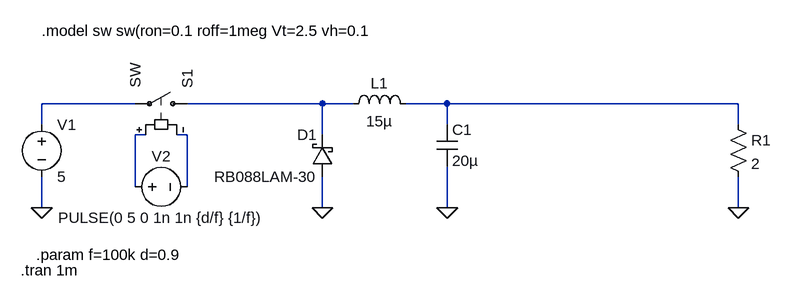
[diagram p0: schematic discrete_buck.asc]
discrete_buck.asc, the LTspice schematic file:
Version 4
SHEET 1 1160 680
WIRE 176 80 32 80
WIRE 464 80 256 80
WIRE 512 80 464 80
WIRE 656 80 592 80
WIRE 1104 80 656 80
WIRE 32 112 32 80
WIRE 656 112 656 80
WIRE 1104 112 1104 80
WIRE 192 128 176 128
WIRE 256 128 240 128
WIRE 464 128 464 80
WIRE 176 208 176 128
WIRE 256 208 256 128
WIRE 32 240 32 192
WIRE 464 240 464 192
WIRE 656 240 656 176
WIRE 1104 240 1104 192
FLAG 32 240 0
FLAG 464 240 0
FLAG 656 240 0
FLAG 1104 240 0
SYMBOL voltage 32 96 R0
WINDOW 123 0 0 Left 0
WINDOW 39 0 0 Left 0
SYMATTR InstName V1
SYMATTR Value 5
SYMBOL sw 272 80 M270
SYMATTR InstName S1
SYMBOL schottky 480 192 R180
WINDOW 0 24 64 Left 2
WINDOW 3 24 0 Left 2
SYMATTR InstName D1
SYMATTR Value RB088LAM-30
SYMATTR Description Diode
SYMATTR Type diode
SYMBOL ind 496 96 R270
WINDOW 0 32 56 VTop 2
WINDOW 3 5 56 VBottom 2
SYMATTR InstName L1
SYMATTR Value 15µ
SYMATTR SpiceLine Rser=0.1
SYMBOL res 1088 96 R0
SYMATTR InstName R1
SYMATTR Value 2
SYMBOL cap 640 112 R0
SYMATTR InstName C1
SYMATTR Value 20µ
SYMATTR SpiceLine Rser=0.02
SYMBOL voltage 160 208 M90
WINDOW 0 -32 56 VBottom 2
WINDOW 3 32 56 VTop 2
WINDOW 123 0 0 Left 0
WINDOW 39 0 0 Left 0
SYMATTR InstName V2
SYMATTR Value PULSE(0 5 0 1n 1n {d/f} {1/f})
TEXT 32 -32 Left 2 !.model sw sw(ron=0.1 roff=1meg Vt=2.5 vh=0.1
TEXT 24 312 Left 2 !.param f=100k d=0.9
TEXT 0 336 Left 2 !.tran 1m

The netlist it stands for:
* discrete_buck.asc
V1 N001 0 5
S1 N002 N001 N004 N005 SW
D1 0 N002 RB088LAM-30
L1 N002 N003 15µ Rser=0.1
R1 N003 0 2
C1 N003 0 20µ Rser=0.02
V2 N004 N005 PULSE(0 5 0 1n 1n {d/f} {1/f})
.model D D
.lib standard.dio
.model sw sw(ron=0.1 roff=1meg Vt=2.5 vh=0.1
.param f=100k d=0.9
.tran 1m
.backanno
.end